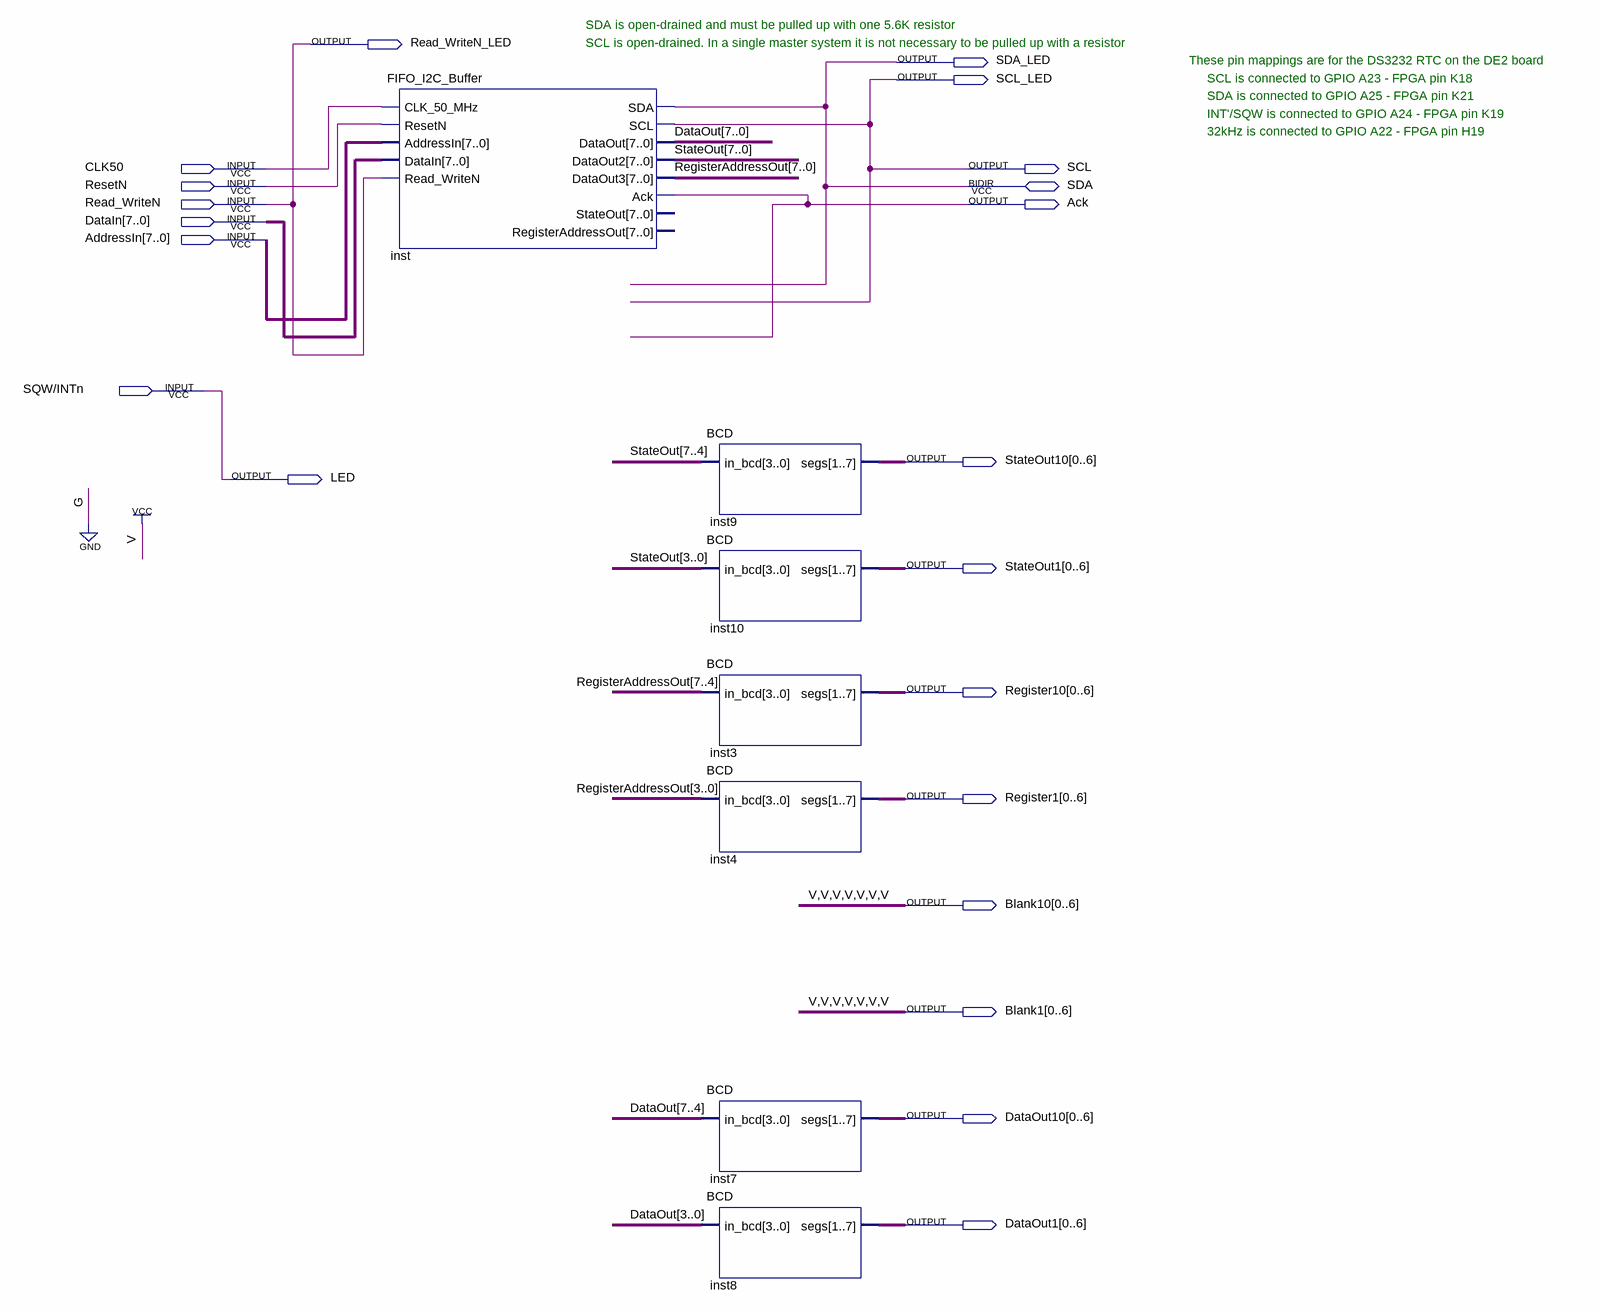
[diagram p0: schematic sheet]
// Quartus schematic de2top.bdf as structural Verilog: 7 symbols, 21 pins
module de2top (
  input  CLK50,
  input  ResetN,
  input  Read_WriteN,
  input  [7:0] DataIn,
  input  [7:0] AddressIn,
  input  \SQW/INTn ,
  inout  SDA,
  output Read_WriteN_LED,
  output SDA_LED,
  output SCL_LED,
  output SCL,
  output Ack,
  output [0:6] StateOut10,
  output LED,
  output [0:6] StateOut1,
  output [0:6] Register10,
  output [0:6] Register1,
  output [0:6] Blank10,
  output [0:6] Blank1,
  output [0:6] DataOut10,
  output [0:6] DataOut1
);

  wire [7:0] DataOut, RegisterAddressOut, StateOut;

  FIFO_I2C_Buffer inst (
    .CLK_50_MHz(CLK50), .ResetN(ResetN), .AddressIn(AddressIn), .DataIn(DataIn), .Read_WriteN(Read_WriteN),
    .SCL(SCL), .DataOut(DataOut), .DataOut2(StateOut), .DataOut3(RegisterAddressOut), .Ack(Ack), .SDA(SDA));  // open: StateOut, RegisterAddressOut
  BCD inst9 (.in_bcd(StateOut[7:4]), .segs(StateOut10));
  BCD inst10 (.in_bcd(StateOut[3:0]), .segs(StateOut1));
  BCD inst3 (.in_bcd(RegisterAddressOut[7:4]), .segs(Register10));
  BCD inst4 (.in_bcd(RegisterAddressOut[3:0]), .segs(Register1));
  BCD inst7 (.in_bcd(DataOut[7:4]), .segs(DataOut10));
  BCD inst8 (.in_bcd(DataOut[3:0]), .segs(DataOut1));

  assign Blank1 = {7{1'b1}};
  assign Blank10 = {7{1'b1}};
  assign LED = \SQW/INTn ;
  assign Read_WriteN_LED = Read_WriteN;
  assign SCL_LED = SCL;
  assign SDA_LED = SDA;

  // Notes on the sheet:
  //   SDA is open-drained and must be pulled up with one 5.6K resistor
  //   SCL is open-drained. In a single master system it is not necessary to be pulled up with a resistor
  //   These pin mappings are for the DS3232 RTC on the DE2 board
  //   SCL is connected to GPIO A23 - FPGA pin K18
  //   SDA is connected to GPIO A25 - FPGA pin K21
  //   INT'/SQW is connected to GPIO A24 - FPGA pin K19
  //   32kHz is connected to GPIO A22 - FPGA pin H19
endmodule
